# EAGLE schematic spinner (EAGLE 7.2.0)
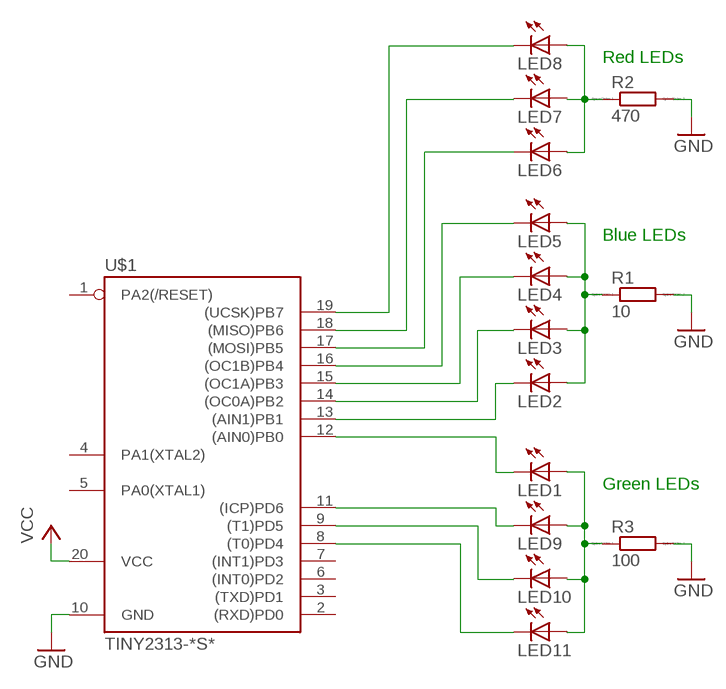
[diagram p0: schematic, sheet 1]

## Parts
LED1  TLLG4400  [LED3MM]
LED2  TLLG4400  [LED3MM]
LED3  TLLG4400  [LED3MM]
LED4  TLLG4400  [LED3MM]
LED5  TLLG4400  [LED3MM]
LED6  TLLG4400  [LED3MM]
LED7  TLLG4400  [LED3MM]
LED8  TLLG4400  [LED3MM]
LED9  TLLG4400  [LED3MM]
LED10  TLLG4400  [LED3MM]
LED11  TLLG4400  [LED3MM]
R1  10  R0207/10  [0207/10]
R2  470  R0207/10  [0207/10]
R3  100  R0207/10  [0207/10]
U$1  TINY2313-*S*  [SO20L$]

## Nets
GND: R1.2 R2.2 R3.2 U$1.10(GND)
N$1: U$1.12((AIN0)PB0)
N$2: U$1.13((AIN1)PB1)
N$3: U$1.14((OC0A)PB2)
N$4: R2.1
N$5: U$1.11((ICP)PD6)
N$6: U$1.15((OC1A)PB3)
N$7: U$1.16((OC1B)PB4)
N$8: U$1.17((MOSI)PB5)
N$9: U$1.18((MISO)PB6)
N$10: U$1.19((UCSK)PB7)
N$11: R1.1
N$12: U$1.9((T1)PD5)
N$13: U$1.8((T0)PD4)
N$14: R3.1
VCC: U$1.20(VCC)
Unconnected: LED1.A LED1.K(C) LED2.A LED2.K(C) LED3.A LED3.K(C) LED4.A LED4.K(C) LED5.A LED5.K(C) LED6.A LED6.K(C) LED7.A LED7.K(C) LED8.A LED8.K(C) LED9.A LED9.K(C) LED10.A LED10.K(C) LED11.A LED11.K(C) U$1.1(PA2(/RESET)) U$1.2((RXD)PD0) U$1.3((TXD)PD1) U$1.4(PA1(XTAL2)) U$1.5(PA0(XTAL1)) U$1.6((INT0)PD2) U$1.7((INT1)PD3)

## Notes on the sheet
- Red LEDs
- Blue LEDs
- Green LEDs

## Library data of the parts
LED1-LED11 = led:TLLG4400: Low Current (2mA) LED 3 mm Tinted Diffused Package color GREEN Source: Data sheet <http://www.farnell.com/datasheets/391098.pdf>; MF: VISHAY SEMICONDUCTOR; OC_FARNELL: 1612435
R1-R3 = eagle-ltspice:R: RESISTOR, European symbol; SPICEMODEL: NONE; SPICEPREFIX: R
U$1 = avr-6:TINY2313*: Atmel Tiny2313 2K Flash, 128 bytes EEPROM, 128 bytes RAM